# EAGLE design Qwiic_Boost (EAGLE 9.5.2)
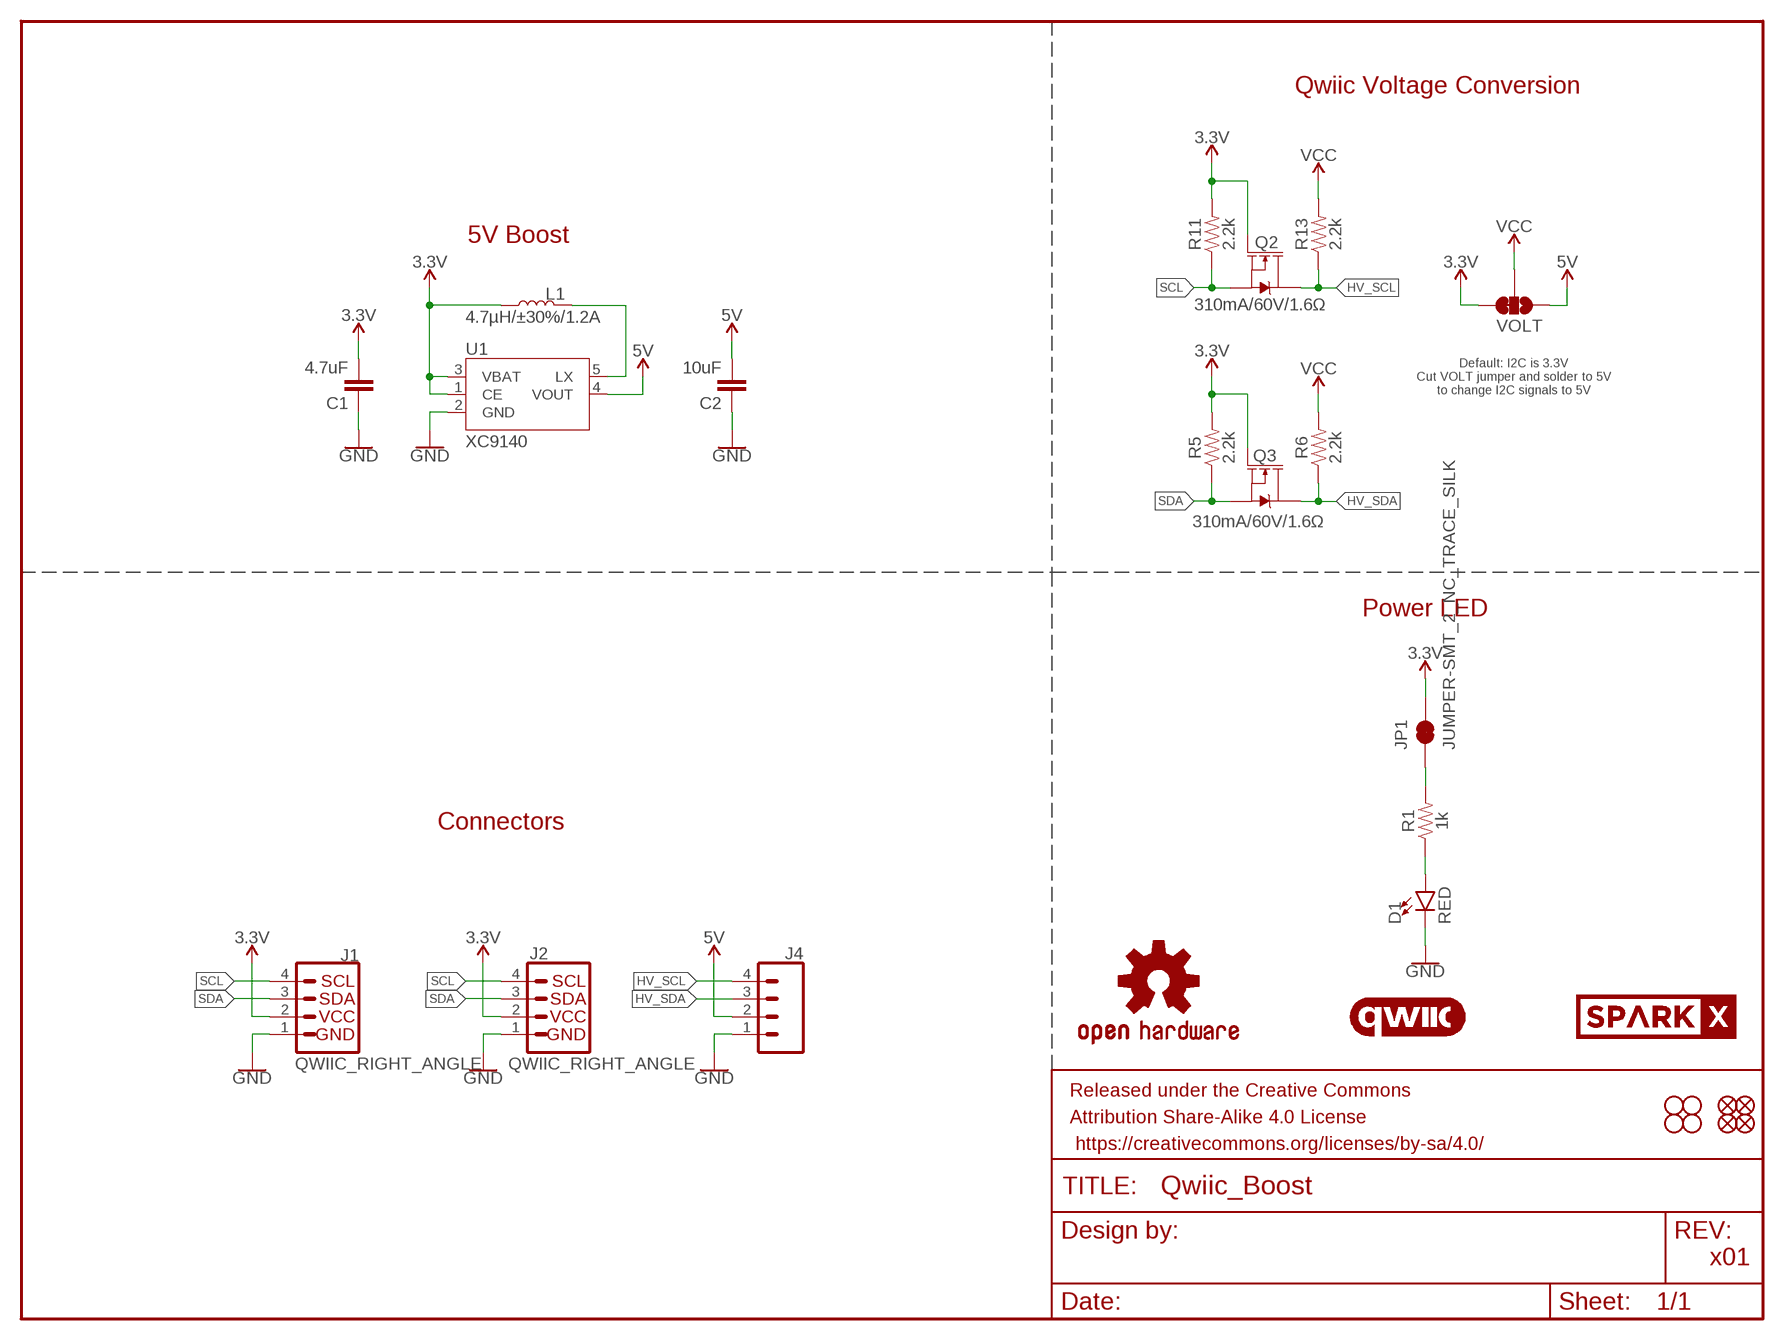
[diagram p0: schematic, sheet 1]

## Parts
C1  4.7uF  4.7UF-0603-6.3V-(10%)  [0603]
C2  10uF  10UF-0603-6.3V-20%  [0603]
D1  RED  LED-RED0603  [LED-0603]
FD1  FIDUCIAL1X2  [FIDUCIAL-1X2]
FD2  FIDUCIAL1X2  [FIDUCIAL-1X2]
FD3  FIDUCIAL1X2  [FIDUCIAL-1X2]
FD4  FIDUCIAL1X2  [FIDUCIAL-1X2]
FRAME1  FRAME-LETTER  [CREATIVE_COMMONS]
H1  STAND-OFF  [STAND-OFF]
H2  STAND-OFF  [STAND-OFF]
H3  STAND-OFF  [STAND-OFF]
H4  STAND-OFF  [STAND-OFF]
J1  QWIIC_RIGHT_ANGLE  QWIIC_CONNECTORJS-1MM  [JST04_1MM_RA]
J2  QWIIC_RIGHT_ANGLE  QWIIC_CONNECTORJS-1MM  [JST04_1MM_RA]
J4  CONN_041X04_NO_SILK_NO_POP  [1X04_NO_SILK]
JP1  JUMPER-SMT_2_NC_TRACE_SILK  [SMT-JUMPER_2_NC_TRACE_SILK]
L1  4.7µH/±30%/1.2A  INDUCTOR-CDRH-4.7UH  [INDUCTOR_4.7UH]
LOGO1  QWIIC_LOGO_CONNECTOR  [QWIIC_5.5MM]
LOGO2  OSHW-LOGOMINI  [OSHW-LOGO-MINI]
Q2  310mA/60V/1.6Ω  MOSFET-NCH-2N7002PW  [SOT323]
Q3  310mA/60V/1.6Ω  MOSFET-NCH-2N7002PW  [SOT323]
R1  1k  1KOHM-0603-1/10W-1%  [0603@1]
R5  2.2k  2.2KOHM-0603-1/10W-1%  [0603]
R6  2.2k  2.2KOHM-0603-1/10W-1%  [0603]
R11  2.2k  2.2KOHM-0603-1/10W-1%  [0603]
R13  2.2k  2.2KOHM-0603-1/10W-1%  [0603]
U1  XC9140  [SOT23-5]
U$8  SPARKX-LOGO4  [SPARKX-MEDIUM]
VOLT  JUMPER-SMT_3_1-NC_TRACE_SILK  [SMT-JUMPER_3_1-NC_TRACE_SILK]

## Nets
3.3V: C1.2 J1.2 J2.2 JP1.2 L1.P$2 Q2.1(G) Q3.1(G) R5.2 R11.2 U1.1(CE) U1.3(VBAT) VOLT.3
5V: C2.2 J4.2 U1.4(VOUT) VOLT.1
GND: C1.1 C2.1 D1.C J1.1 J2.1 J4.1 U1.2(GND)
HV_SCL: J4.4 Q2.3(D) R13.1
HV_SDA: J4.3 Q3.3(D) R6.1
N$1: D1.A R1.1
N$2: L1.P$1 U1.5(LX)
N$3: JP1.1 R1.2
SCL: J1.4 J2.4 Q2.2(S) R11.1
SDA: J1.3 J2.3 Q3.2(S) R5.1
VCC: R6.2 R13.2 VOLT.2

## Notes on the sheet
- Qwiic Voltage Conversion
- 5V Boost
- Default: I2C is 3.3V
  Cut VOLT jumper and solder to 5V
  to change I2C signals to 5V
- Power LED
- Connectors
- x01

## Library data of the parts
C1 = SparkFun-Capacitors:4.7UF: 4.7µF ceramic capacitors A capacitor is a passive two-terminal electrical component used to store electrical energy temporarily in an electric field.; PROD_ID: CAP-08280
C2 = SparkFun-Capacitors:10UF: 10.0µF ceramic capacitors A capacitor is a passive two-terminal electrical component used to store electrical energy temporarily in an electric field.; PROD_ID: CAP-11015
D1 = SparkFun-LED:LED-RED: Red SMD LED Used in manufacturing of most products at SparkFun Packages: 0603 - SMD 0603 package [Product Link] <http://docs.avagotech.com/docs/AV02-0551EN> 0603 SMART - SMD 0603 SMART package ( more efficient and expensive)[Product Link] <http://www.osram-os.com/Graphics/XPic2/00077099_0.pdf> 1206 - SMD1206 package [Product Link] <https://www.sparkfun.com/datasheets/DevTools/LilyPad/Q150OVS4.pdff> SparkFun Products: Pro Mini 328 -5V <https://www.sparkfun.com/products/821> RedBoard <https://www.sparkfun.com/products/12757> IOIO-OTG <https://www.sparkfun.com/products/13613>; PROD_ID: DIO-00819
FD1-FD4 = SparkFun-Aesthetics:FIDUCIAL: Fiducial Alignment Points Point-of-reference for pick-and-place machines and other optical instruments.
FRAME1 = SparkFun-Aesthetics:FRAME-LETTER: Schematic Frame - Letter Standard 8.5x11 US Letter frame
H1-H4 = SparkFun-Hardware:STAND-OFF: Stand Off Drill holes for mechanically mounting via screws, standoffs, etc. Note: Use the keepout ring to avoid running the screw head into surrounding components. Variant Overviews STAND-OFF - Mechanical footprint for a #4 phillips button head screw. STAND-OFF-TIGHT - Mechanical footprint for a #4 phillips button head screw, Example SparkFun Products Screw - Phillips Head (1/4", 4-40, 10 pack) <https://www.sparkfun.com/products/10453> (PRT-10453) Screw - Phillips Head (1/2", 4-40, 10 pack) <https://www.sparkfun.com/products/10452> (PRT-10452) Screw - Phillips Head (3/4", 4-40, 10 pack) <https://www.sparkfun.com/products/10451> (PRT-10451) Screw - Phillips Head (1", 4-40, 10 pack) <https://www.sparkfun.com/products/10450> (PRT-10450)
J1 J2 = SparkFun-Connectors:QWIIC_CONNECTOR: SparkFun I2C Standard Qwiic Connector An SMD 1mm pitch JST connector makes it easy and quick (get it? Qwiic?) to connect I2C devices to each other. The Qwiic system <http://www.sparkfun.com/qwiic> enables fast and solderless connection between popular platforms and various sensors and actuators. We carry 200mm <https://www.sparkfun.com/products/14204>, 100mm <https://www.sparkfun.com/products/14205>, 50mm <https://www.sparkfun.com/products/14206>, and breadboard friendly <https://www.sparkfun.com/products/14207> Qwiic cables. We also offer 10 pcs strips <https://www.sparkfun.com/products/14323> the SMD connectors.; PROD_ID: CONN-13694
J4 = SparkFun-Connectors:CONN_04: Multi connection point. Often used as Generic Header-pin footprint for 0.1 inch spaced/style header connections On any of the 0.1 inch spaced packages, you can populate with these: Break Away Headers - Straight <https://www.sparkfun.com/products/116> (PRT-00116) Break Away Male Headers - Right Angle <https://www.sparkfun.com/products/553> (PRT-00553) Female Headers <https://www.sparkfun.com/products/115> (PRT-00115) Break Away Headers - Machine Pin <https://www.sparkfun.com/products/117> (PRT-00117) Break Away Female Headers - Swiss Machine Pin <https://www.sparkfun.com/products/743> (PRT-00743) For SCREWTERMINALS and SPRING TERMINALS visit here: Screw Terimnals on SparkFun.com <https://www.sparkfun.com/search/results?term=Screw+Terminals> (5mm/3.5mm/2.54mm spacing) This device is also useful as a general connection point to wire up your design to another part of your project. Our various solder wires solder well into these plated through hole pads. Hook-Up Wire - Assortment (Stranded, 22 AWG) <https://www.sparkfun.com/products/11375> (PRT-11375) Hook-Up Wire - Assortment (Solid Core, 22 AWG) <https://www.sparkfun.com/products/11367> (PRT-11367) View the entire wire category on our website here <https://www.sparkfun.com/categories/141> Special notes: Molex polarized connector foot print use with SKU : PRT-08231 with associated crimp pins and housings. 1MM SMD Version SKU: PRT-10208
JP1 = SparkFun-Jumpers:JUMPER-SMT_2_NC_TRACE: Normally closed trace jumper This jumper has a trace between two pads so it's normally closed (NC). Use a razor knife to open the connection. For best results follow the IPC guidelines for cutting traces: Cutout at least 0.063 mm (0.005 in). Remove all loose material to clean up the cut area. Seal the cut with an approved epoxy. Reapply solder to reclose the connection.
L1 = SparkFun-Coils:INDUCTOR: Inductors Resist changes in electrical current. Basically a coil of wire. SparkFun Products: SparkFun Load Cell Amplifier - HX711 <https://www.sparkfun.com/products/13879> IOIO-OTG - V2.2 <https://www.sparkfun.com/products/13613>; PROD_ID: NDUC-10146
LOGO1 = SparkFun-Aesthetics:QWIIC_LOGO: Qwiic Logos for placement on schematic and PCB. The 5.5mm silk logo is best for placing next to Qwiic connector.
LOGO2 = SparkFun-Aesthetics:OSHW-LOGO: Open-Source Hardware (OSHW) Logo This logo indicates the piece of hardware it is found on incorporates a OSHW license and/or adheres to the definition of open source hardware found here: http://freedomdefined.org/OSHW
Q2 Q3 = SparkFun-DiscreteSemi:MOSFET-NCH: N-channel MOSFETs Voltage controlled devices that allow control of high current outputs. SparkFun Products: SparkFun OpenScale <https://www.sparkfun.com/products/13261> SparkFun Digital Sandbox <https://www.sparkfun.com/products/12651> SparkFun Monster Moto Shield <https://www.sparkfun.com/products/10182> SparkFun MOSFET Power Controller <https://www.sparkfun.com/products/11214>; PROD_ID: TRANS-11151
R1 = SparkFun-Resistors:1KOHM: 1kΩ resistor A resistor is a passive two-terminal electrical component that implements electrical resistance as a circuit element. Resistors act to reduce current flow, and, at the same time, act to lower voltage levels within circuits. - Wikipedia; PROD_ID: RES-07856
R5 R6 R11 R13 = SparkFun-Resistors:2.2KOHM: 2.2kΩ resistor A resistor is a passive two-terminal electrical component that implements electrical resistance as a circuit element. Resistors act to reduce current flow, and, at the same time, act to lower voltage levels within circuits. - Wikipedia; PROD_ID: RES-08272
U1 = SparkFun-IC-Power:XC9140
U$8 = SparkX:SPARKX-LOGO
VOLT = SparkFun-Jumpers:JUMPER-SMT_3_1-NC_TRACE: Normally closed trace jumper (1 of 2 connections) This jumper has a trace between two pads so it's normally closed (NC). The other connection is normally open (NO). Use a razor knife to open the connection. For best results follow the IPC guidelines for cutting traces: Cutout at least 0.063 mm (0.005 in). Remove all loose material to clean up the cut area. Seal the cut with an approved epoxy. Reapply solder to reclose the connection, or to close the NO connection.

## Net classes
0 default: width 0 mm, drill 0 mm
1 power: width 0.762 mm

## Board
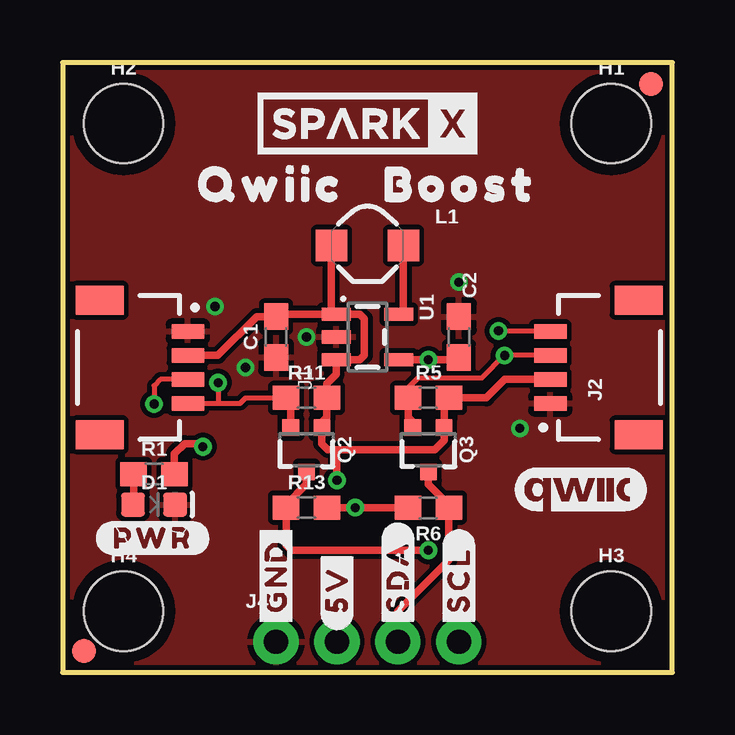
[diagram p1: board, top side]
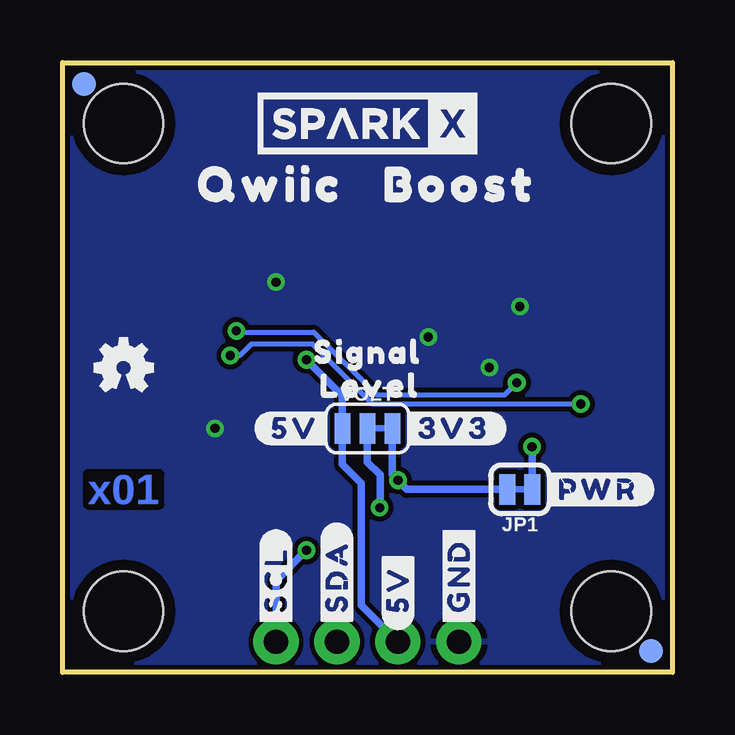
[diagram p2: board, bottom side, seen from below]

Size 25.4 x 25.4 mm. Coordinates in mm from the lower left corner, seen from the top.
Outline: 25.4,25.4 0,25.4 0,0 25.4,0 25.4,25.4
Copper layers (1*16): Top 0.035mm / dielectric 1.5mm / Bottom 0.035mm
Design rules "SparkFun-2-layer-TIGHT": minimum track width 7mil, minimum drill 15mil, track to track 7mil, track to pad 7mil, pad to pad 7mil, via to via 7mil, smd to smd 7mil, copper to edge 7mil, drill to drill 7mil, minimum pad ring 7mil, minimum via ring 7mil, stop-mask expansion 4mil, vias tented up to drill 25mil, thermal gap 10mil

### Footprints (pad centres in the part's own frame; a part is rotated, then mirrored left to right if it is on the bottom)
0603 = smd 1.1 x 1: 1 -0.85,0; 2 0.85,0
LED-0603 = smd 1 x 1: A -0.877,0; C 0.877,0
FIDUCIAL-1X2 = smd 1 x 1: 1 0,0
STAND-OFF = hole 3.302: 0,0
JST04_1MM_RA = smd 0.6 x 1.35: 1 -1.5,0; 2 -0.5,0; 3 0.5,0; 4 1.5,0 | smd 1.2 x 2: NC1 2.8,-3.675; NC2 -2.8,-3.675
1X04_NO_SILK = drill 1.016 pad 1.88: 1 0,0; 2 2.54,0; 3 5.08,0; 4 7.62,0
SMT-JUMPER_2_NC_TRACE_SILK = smd 0.66 x 1.27: 1 -0.521,0; 2 0.521,0
INDUCTOR_4.7UH = smd 1.3 x 1.3: P$1 -1.5,0; P$2 1.5,0
SOT323 = smd 0.7 x 0.7: 1 -0.65,-0.925; 2 0.65,-0.925; 3 0,0.925
0603@1 = smd 1.1 x 1: 1 -0.85,0; 2 0.85,0
SOT23-5 = smd 0.55 x 1.2: 1 -0.95,-1.3; 2 0,-1.3; 3 0.95,-1.3; 4 0.95,1.3; 5 -0.95,1.3
SMT-JUMPER_3_1-NC_TRACE_SILK = smd 0.66 x 1.27: 1 -1.041,0; 2 0,0; 3 1.041,0

### Placement (x,y rotation side)
C1  8.89,13.97 90 top
C2  16.51,13.97 270 top
D1  3.81,6.99 0 top
FD1  0.89,0.89 0 top
FD2  0.89,0.89 0 bottom
FD3  24.51,24.51 0 top
FD4  24.51,24.51 0 bottom
FRAME1  -10.16,-11.43 0 top  (outside the outline)
H1  22.86,22.86 0 top
H2  2.54,22.86 0 top
H3  22.86,2.54 0 top
H4  2.54,2.54 0 top
J1  5.21,12.7 270 top
J2  20.32,12.7 90 top
J4  8.89,1.27 0 top
JP1  6.35,7.62 180 bottom
L1  12.7,17.78 180 top
LOGO1  21.59,7.62 0 top
LOGO2  22.86,12.7 0 bottom
Q2  10.16,9.27 180 top
Q3  15.24,9.27 180 top
R1  3.81,8.26 0 top
R5  15.24,11.43 0 top
R6  15.24,6.86 180 top
R11  10.16,11.43 0 top
R13  10.16,6.86 0 top
U1  12.7,13.97 270 top
U$1  [#5V#3]  11.43,1.78 90 top
U$2  [#5V#3]  11.43,1.78 90 bottom
U$3  [#GND#0]  8.89,1.78 90 bottom
U$4  [#GND#0]  8.89,1.78 90 top
U$5  [#PWR#4]  1.4,5.59 0 top
U$6  [#SCL#2]  16.51,1.78 90 top
U$7  [#SDA#1]  13.97,1.78 90 top
U$8  12.7,22.86 0 top
U$9  [#SDA#1]  13.97,1.78 90 bottom
U$10  [#SCL#2]  16.51,1.78 90 bottom
U$11  [BOOST1]  12.32,20.32 0 top
U$12  [QWIIC0]  4.57,20.32 0 top
U$13  [#3V3#2]  11.3,10.16 0 bottom
U$14  [#5V#3]  17.4,10.16 0 bottom
U$15  [#PWR#0]  5.46,7.62 0 bottom
U$16  [LEVEL1]  15.37,11.94 0 bottom
U$17  [SIGNAL0]  15.62,13.34 0 bottom
U$18  [QWIIC0]  20.83,20.32 0 bottom
U$19  [BOOST1]  13.08,20.32 0 bottom
U$20  SPARKX-LOGO4  [SPARKX-MEDIUM]  12.7,22.86 0 bottom
VOLT  12.7,10.16 0 bottom

### Tracks (layer width: path | path; a pad name or v marks a point on that pad's centre or on a via)
3.3V  (via drill 0.38)
  Top 0.305: J1.2 6.47,13.2 8.09,14.82 8.76,14.82 | 8.76,14.82 C1.2 | U1.1 8.86,14.92 8.76,14.82 | U1.1 11.2,15.12 L1.P$2 | U1.1 12.38,14.92 12.57,14.73 12.57,13.21 12.38,13.02 U1.3 11.4,12.42 11.01,12.03 R11.2 11.01,10.63 10.79,10.41 10.79,10.21 Q2.1 10.79,10.18 10.79,9.53 11.05,9.27 11.43,9.27 | J2.2 18.42,12.2 17.65,11.43 16.26,11.43 | 16.26,11.43 R5.2 | 16.26,11.43 15.89,11.06 Q3.1 15.89,9.67 15.49,9.27 11.43,9.27 | v11.43,8 11.43,9.27
  Bottom 0.305: VOLT.3 11.66,8.23 v11.43,8 11.43,7.99 11.06,7.62 JP1.2
5V  (via drill 0.38)
  Top 0.305: U1.4 v15.24,13.02 16.41,13.02 C2.2
  Bottom 0.305: J4.2 12.95,2.79 12.95,7.87 13.74,8.66 VOLT.1 13.74,11.52 v15.24,13.02
GND  (via drill 0.38)
  other vias: 10.16,13.97 6.35,15.24 16.51,16.26 7.62,12.7 19.05,10.16
  pour Top (isolate 0.203): 0,25.4 25.4,25.4 25.4,0 0,0
  pour Bottom (isolate 0.203): 0,25.4 25.4,25.4 25.4,0 0,0
HV_SCL  (via drill 0.38)
  Top 0.305: Q2.3 10.16,7.84 9.31,6.99 R13.1 9.31,5.29 9.53,5.08 v15.24,5.08
  Bottom 0.305: v15.24,5.08 16.51,3.81 J4.4
HV_SDA
  Top 0.305: Q3.3 15.24,7.84 16.09,6.99 R6.1 16.09,4.66 13.97,2.54 J4.3
N$1
  Top 0.305: R1.1 2.96,7.01 D1.A
N$2
  Top 0.305: L1.P$1 14.2,15.12 U1.5
N$3  (via drill 0.38)
  Top 0.305: R1.2 4.66,9.11 5.08,9.53 5.71,9.53 v5.84,9.4
  Bottom 0.305: v5.84,9.4 5.84,7.63 JP1.1
SCL  (via drill 0.38)
  Top 0.203: J1.4 6.48,11.2 | 6.48,11.2 7.39,11.2 7.62,11.43 R11.1 | v18.16,14.22 18.18,14.2 J2.4 | v6.48,12.06 6.48,11.2
  Top 0.305: Q2.2 9.51,11.23 R11.1
  Bottom 0.203: v18.16,14.22 18.11,14.18 14.94,14.18 12.32,11.56 6.99,11.56 v6.48,12.06
SDA  (via drill 0.38)
  Top 0.203: R5.1 14.39,11.85 14.81,12.27 17.48,12.27 v18.41,13.2 J2.3 | v3.81,11.18 3.81,11.94 4.07,12.2 J1.3
  Top 0.305: Q3.2 14.59,10.43 14.39,10.63 R5.1
  Bottom 0.203: v3.81,11.18 12.48,11.18 14.97,13.67 17.54,13.67 18.01,13.2 v18.41,13.2
VCC  (via drill 0.38)
  Top 0.305: R13.2 v12.19,6.86 R6.2
  Bottom 0.305: VOLT.2 12.7,8.76 12.17,8.22 12.17,6.88 v12.19,6.86

### Text on the board
Bottom: x01